# Altium schematic sheet 3_control.schdoc
size 309 x 223 mm; Symbol: Sheet-Symbol_A4; Device: Sheet-Symbol_A4; @Page Name: control; @Create Date: 2023-12-22; @Page Count: 3; @Page No: 3; @Project Name: DDS; @Schematic Name: DDS_1; @Update Date: 2023-12-27; Company: 嘉立创EDA; Page Size: A3; Version: V1.0
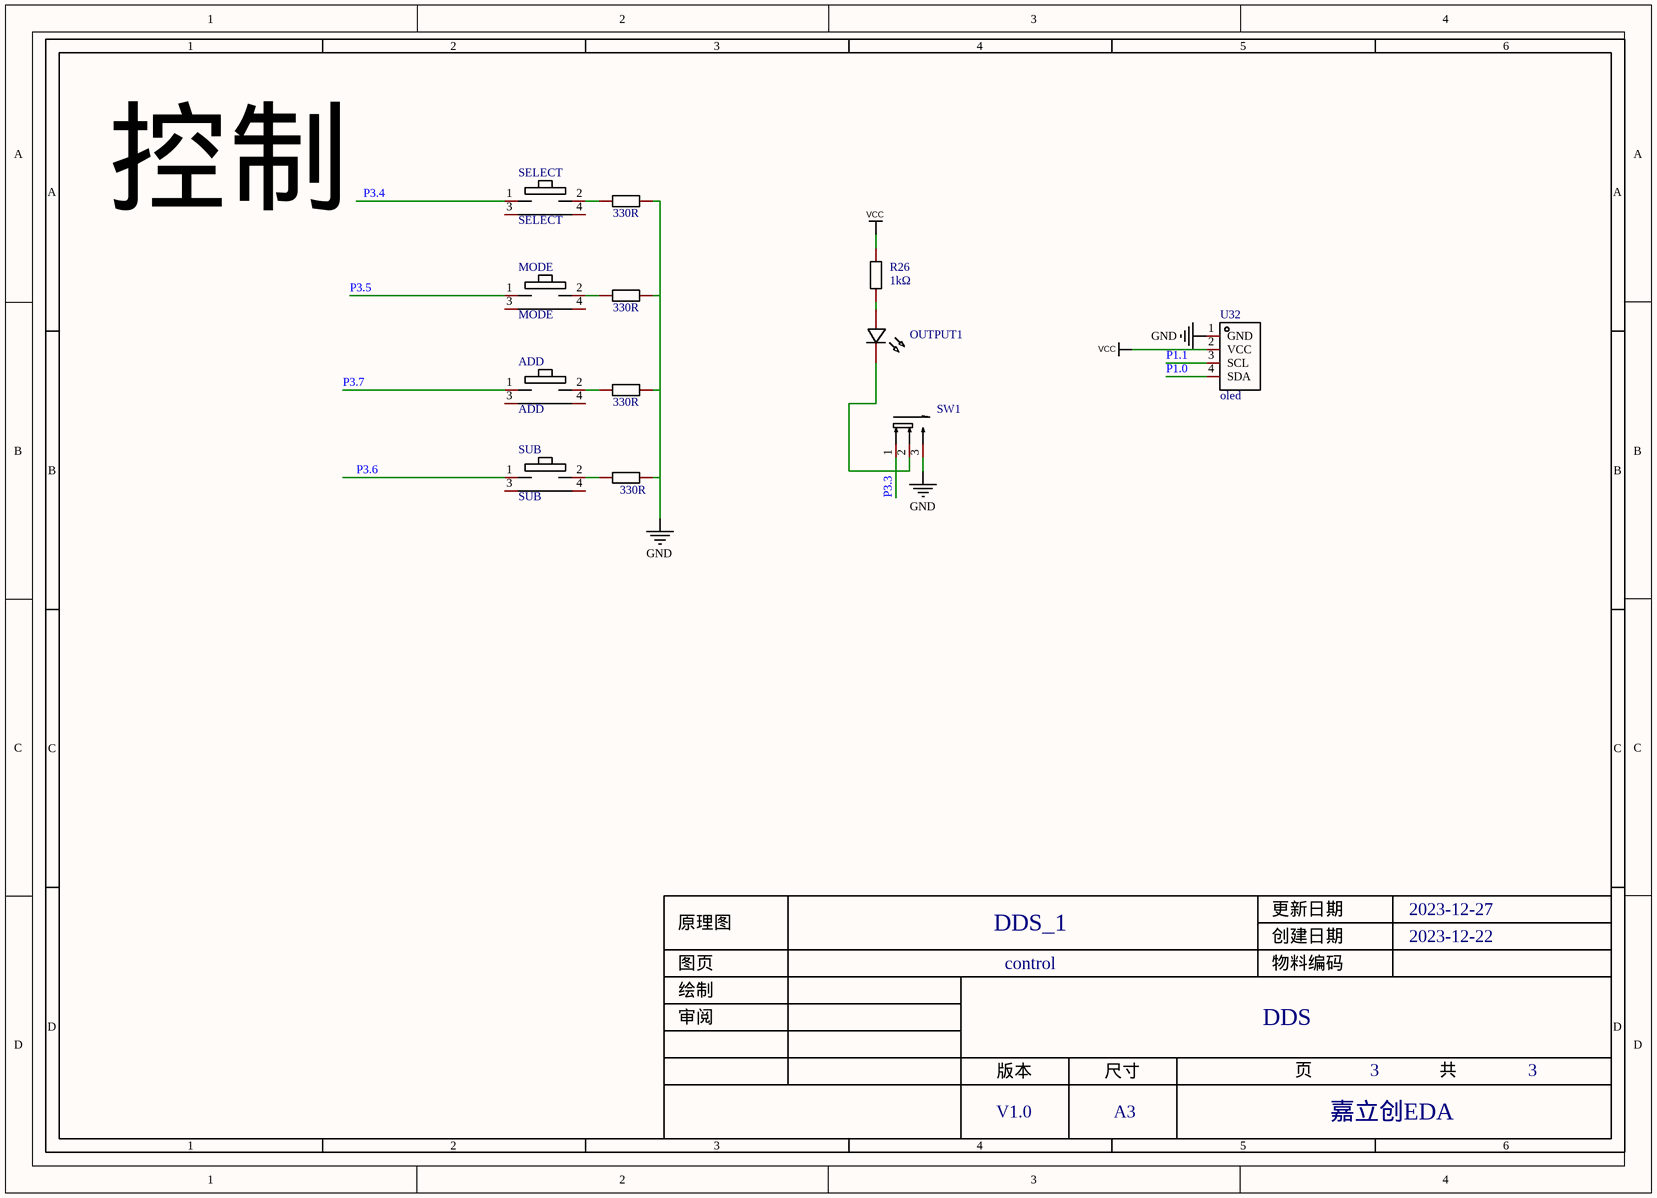
[diagram p0: 3_control.schdoc]

## Parts
ADD  ADD  [KEY-SMD_4P-L7.8-W2.8-P4.20-EH]
MODE  MODE  [KEY-SMD_4P-L7.8-W2.8-P4.20-EH]
OUTPUT1  LED_B  [LED_0805]  (value not drawn)
R26  1kΩ  [R0805]
R27  330R  [R0805]
R28  330R  [R0805]
R29  330R  [R0805]
R30  330R  [R0805]
SELECT  SELECT  [KEY-SMD_4P-L7.8-W2.8-P4.20-EH]
SUB  SUB  [KEY-SMD_4P-L7.8-W2.8-P4.20-EH]
SW1  XKB5858-Z-C  [SW-TH_XKB5858-Z-C]  (value not drawn)
U32  oled  [OLED-TH_L27.8-W27.2-P2.54_C9900033791]

## Nets
GND: R27.1 R28.1 R29.1 R30.1 SW1.3 U32.1(GND)
VCC: R26.2 U32.2(VCC)
P1.0: U32.4(SDA)
P1.1: U32.3(SCL)
P3.3: OUTPUT1.1(C) SW1.1 SW1.2
P3.4: SELECT.1
P3.5: MODE.1
P3.6: SUB.1
P3.7: ADD.1
NetADD_2: ADD.2 R29.2
NetMODE_2: MODE.2 R28.2
NetOUTPUT1_2: OUTPUT1.2(A) R26.1
NetR27_2: R27.2 SELECT.2
NetR30_2: R30.2 SUB.2

Not connected (* = marked no-connect by the designer): ADD 3 4; MODE 3 4; SELECT 3 4; SUB 3 4

## Notes on the sheet
- 控制
- 1
- 2
- 3
- 4
- 5
- 6
- A
- B
- C
- 原理图
- DDS_1
- 创建日期
- 更新日期
- 2023-12-22
- 2023-12-27
- 审阅
- 绘制
- 图页
- control
- 物料编码
- DDS
- D
- 版本
- 尺寸
- 页
- 共
- V1.0
- A3
- 嘉立创EDA

## Library data of the parts
ADD MODE SELECT SUB = TS-1087B-B2D2: 电路结构:单刀单掷;按钮作用方向:侧面触动;致动器样式:矩形按钮;照明颜色:-;作用力:180gf ±30gf;开关高度:3.5mm;; Manufacturer: Yuandi(元迪); Add into BOM: yes; Circuit: 单刀单掷; Actuator Orientation: 侧面触动; Actuator Style: 矩形按钮; Switch Height: 3.5mm; Symbol: TS-1087B-B2D2; Device: TS-1087B-B2D2; LCSC Part Name: 轻触开关7.0*2.3*3.5有柱黑柄侧按侧贴180gf; Supplier Part: C498303; Supplier Footprint: -; Datasheet: https://atta.szlcsc.com/upload/public/pdf/source/20200318/C498302_5CF788D07D014771B0E800D7BCB3EFA7.pdf; Supplier: LCSC; Convert to PCB: yes; Illumination Color: -; Operating Force: 180gf ±30gf
  ADD: Name: ADD; Manufacturer Part: ADD
  MODE: Name: MODE; Manufacturer Part: MODE
  SELECT: Name: SELECT; Manufacturer Part: SELECT
  SUB: Name: SUB; Manufacturer Part: SUB
OUTPUT1 = LED_B: Convert to PCB: yes; Symbol: LED_B; Device: LED_B; Add into BOM: yes; Supplier Footprint: 0805
R26-R30 = 0805W8F1001T5E: 阻值:1kΩ;精度:±1%;功率:125mW;温度系数:±100ppm/℃;电阻类型:厚膜电阻;; Manufacturer: UNI-ROYAL(厚声); Add into BOM: yes; Tolerance: ±1%; Power(Watts): 125mW; Overload Voltage (Max): 150V; Symbol: 0805W8F1001T5E; Device: 0805W8F1001T5E; LCSC Part Name: 1kΩ ±1% 125mW 厚膜电阻; Supplier Part: C17513; Manufacturer Part: 0805W8F1001T5E; Supplier Footprint: 0805; Datasheet: https://atta.szlcsc.com/upload/public/pdf/source/20200306/C422600_1E6D84923E4A46A82E41ADD87F860B5C.pdf; Supplier: LCSC; Convert to PCB: yes; Temperature Coefficient: ±100ppm/℃; Type: 厚膜电阻; Operating Temperature Range: -55℃~+155℃
  R26: Name: 1kΩ; Value: 1kΩ
  R27-R30: Name: 330R; Value: 330R
SW1 = XKB5858-Z-C: 触点电流:100mA;额定电压 (AC):250V;额定电压 (DC):30V;绝缘电阻:100MΩ;电路结构:-;安装方式:卧插;自锁/无锁:自锁;按键形状:矩形按钮;按键/盖帽颜色:白色;带灯:无;引脚样式:PC引脚;作用力:160gf@±80gf;防护等级:-;工作温度:-15℃~+55℃;机械寿命:10000;; Manufacturer: XKB Connectivity(中国星坤); Add into BOM: yes; Contact Current: 100mA; Voltage Rating (AC): 250V; Voltage Rating (DC): 30V; Insulation Resistance: 100MΩ; Self Lock / No Lock: 自锁; Actuator Style: 矩形按钮; Actuator/Cap Color: 白色; With Lamp: 无; Pin Style: PC引脚; Mechanical Life: 10000; Name: XKB5858-Z-C; Symbol: XKB5858-Z-C; Device: XKB5858-Z-C; LCSC Part Name: 按键开关  5.8*5.8侧边插脚自锁; Supplier Part: C318865; Manufacturer Part: XKB5858-Z-C; Supplier Footprint: 插件; Datasheet: https://atta.szlcsc.com/upload/public/pdf/source/20200227/C318865_806C1898A28533892EA4A080484E0BBB.pdf; Supplier: LCSC; Convert to PCB: yes; Circuit: -; Mounting Style: 卧插; Operating Force: 160gf@±80gf; IP Rating: -; Operating Temperature: -15℃~+55℃
U32 = HS96L03W2C03: 尺寸(inch)：0.96寸 0.96apos; 像素分辨率：128x64 128*64主控芯片：SSD1315 接口类型：I2C 外形:27.3*27.8；IIC/3SPI/4SPI串口通讯,工作温度范围-40℃—+70℃。4PIN黑底白光。; Manufacturer: HS(汉昇); Add into BOM: yes; Name: oled; Symbol: HS96L03W2C03; Device: HS96L03W2C03; LCSC Part Name: 0.96寸OLED显示屏窄白光IIC; Supplier Part: C5248080; Manufacturer Part: oled; Supplier Footprint: -; Datasheet: https://atta.szlcsc.com/upload/public/pdf/source/20230627/763D01F79A90007632F098068C7C8AD9.pdf; Supplier: LCSC; Convert to PCB: yes